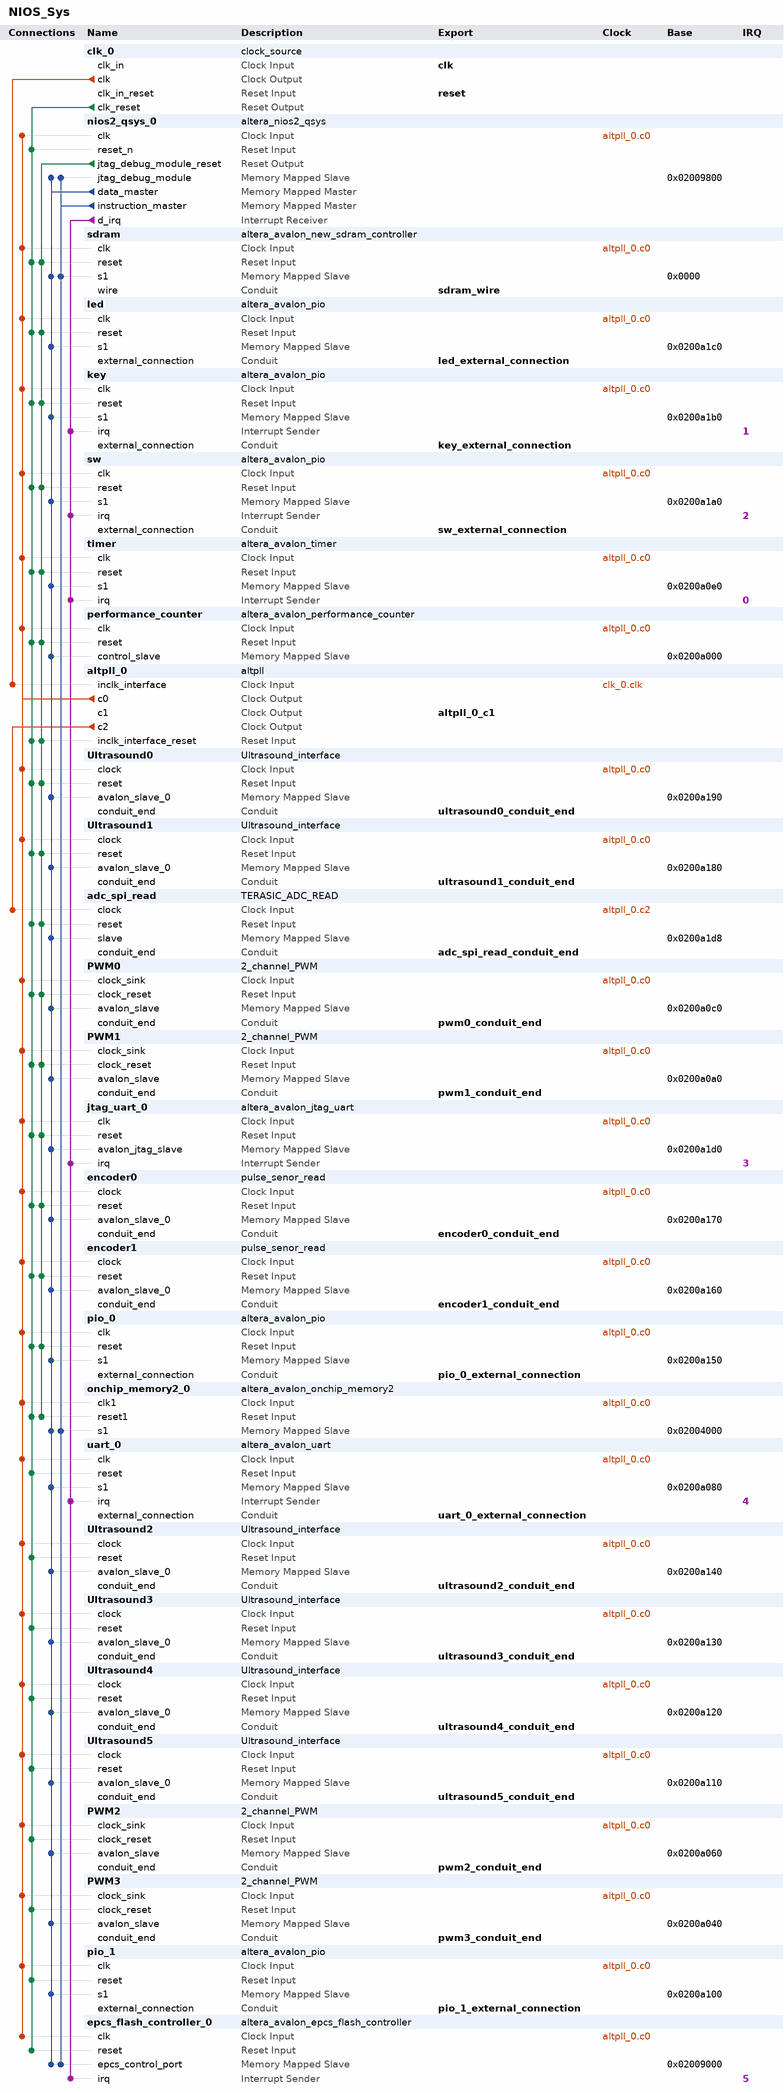
[diagram p0: system contents]
# Platform Designer (Qsys) system NIOS_Sys, Cyclone IV E EP4CE22F17C6
# Parameters at their usual value, and those the tool derives, are not listed.
package require -exact qsys 13.0.1.99.2
create_system NIOS_Sys
set_project_property DEVICE_FAMILY {Cyclone IV E}
set_project_property DEVICE EP4CE22F17C6

add_instance clk_0 clock_source 13.0
set_instance_parameter_value clk_0 clockFrequency 50000000

add_instance nios2_qsys_0 altera_nios2_qsys 13.0
set_instance_parameter_value nios2_qsys_0 resetSlave epcs_flash_controller_0.epcs_control_port
set_instance_parameter_value nios2_qsys_0 mmu_TLBMissExcSlave None
set_instance_parameter_value nios2_qsys_0 exceptionSlave sdram.s1
set_instance_parameter_value nios2_qsys_0 breakSlave nios2_qsys_0.jtag_debug_module
set_instance_parameter_value nios2_qsys_0 impl Tiny
set_instance_parameter_value nios2_qsys_0 icache_size 4096
set_instance_parameter_value nios2_qsys_0 dcache_size 4096

add_instance sdram altera_avalon_new_sdram_controller 13.0.1.99.2
set_instance_parameter_value sdram TAC 5.5
set_instance_parameter_value sdram TRCD 20.0
set_instance_parameter_value sdram TRP 20.0
set_instance_parameter_value sdram casLatency 3
set_instance_parameter_value sdram columnWidth 9
set_instance_parameter_value sdram dataWidth 16
set_instance_parameter_value sdram generateSimulationModel true
set_instance_parameter_value sdram model single_Micron_MT48LC4M32B2_7_chip
set_instance_parameter_value sdram numberOfBanks 4
set_instance_parameter_value sdram numberOfChipSelects 1
set_instance_parameter_value sdram powerUpDelay 100.0
set_instance_parameter_value sdram refreshPeriod 15.625
set_instance_parameter_value sdram rowWidth 13

add_instance led altera_avalon_pio 13.0.1.99.2
set_instance_parameter_value led direction Output
set_instance_parameter_value led width 8

add_instance key altera_avalon_pio 13.0.1.99.2
set_instance_parameter_value key captureEdge true
set_instance_parameter_value key direction Input
set_instance_parameter_value key edgeType FALLING
set_instance_parameter_value key generateIRQ true
set_instance_parameter_value key irqType EDGE
set_instance_parameter_value key width 2

add_instance sw altera_avalon_pio 13.0.1.99.2
set_instance_parameter_value sw captureEdge true
set_instance_parameter_value sw direction Input
set_instance_parameter_value sw edgeType ANY
set_instance_parameter_value sw generateIRQ true
set_instance_parameter_value sw irqType EDGE
set_instance_parameter_value sw width 4

add_instance timer altera_avalon_timer 13.0.1.99.2
set_instance_parameter_value timer period 1
set_instance_parameter_value timer periodUnits MSEC

add_instance performance_counter altera_avalon_performance_counter 13.0.1.99.2
set_instance_parameter_value performance_counter numberOfSections 3

add_instance altpll_0 altpll 13.0
set_instance_parameter_value altpll_0 INCLK0_INPUT_FREQUENCY 20000
set_instance_parameter_value altpll_0 CLK0_MULTIPLY_BY 1
set_instance_parameter_value altpll_0 CLK1_MULTIPLY_BY 1
set_instance_parameter_value altpll_0 CLK2_MULTIPLY_BY 1
set_instance_parameter_value altpll_0 CLK0_DIVIDE_BY 1
set_instance_parameter_value altpll_0 CLK1_DIVIDE_BY 1
set_instance_parameter_value altpll_0 CLK2_DIVIDE_BY 25
set_instance_parameter_value altpll_0 CLK1_PHASE_SHIFT -3333
set_instance_parameter_value altpll_0 CLK2_PHASE_SHIFT 0
set_instance_parameter_value altpll_0 CLK1_DUTY_CYCLE 50
set_instance_parameter_value altpll_0 CLK2_DUTY_CYCLE 50
set_instance_parameter_value altpll_0 PORT_clk1 PORT_USED
set_instance_parameter_value altpll_0 PORT_clk2 PORT_USED
set_instance_parameter_value altpll_0 PORT_clk3 PORT_UNUSED
set_instance_parameter_value altpll_0 PORT_ARESET PORT_UNUSED
set_instance_parameter_value altpll_0 PORT_LOCKED PORT_UNUSED

add_instance Ultrasound0 Ultrasound_interface 1.0
set_instance_parameter_value Ultrasound0 idle 1
set_instance_parameter_value Ultrasound0 trigger 2
set_instance_parameter_value Ultrasound0 wait_feedback 4
set_instance_parameter_value Ultrasound0 measure_feedback 8

add_instance Ultrasound1 Ultrasound_interface 1.0
set_instance_parameter_value Ultrasound1 idle 1
set_instance_parameter_value Ultrasound1 trigger 2
set_instance_parameter_value Ultrasound1 wait_feedback 4
set_instance_parameter_value Ultrasound1 measure_feedback 8

add_instance adc_spi_read TERASIC_ADC_READ 1.0

add_instance PWM0 2_channel_PWM 1.0

add_instance PWM1 2_channel_PWM 1.0

add_instance jtag_uart_0 altera_avalon_jtag_uart 13.0.1.99.2
set_instance_parameter_value jtag_uart_0 simInteractiveOptions NO_INTERACTIVE_WINDOWS

add_instance encoder0 pulse_senor_read 1.0

add_instance encoder1 pulse_senor_read 1.0

add_instance pio_0 altera_avalon_pio 13.0.1.99.2
set_instance_parameter_value pio_0 direction Output
set_instance_parameter_value pio_0 width 8

add_instance onchip_memory2_0 altera_avalon_onchip_memory2 13.0.1.99.2
set_instance_parameter_value onchip_memory2_0 dataWidth 32
set_instance_parameter_value onchip_memory2_0 dualPort false
set_instance_parameter_value onchip_memory2_0 initMemContent true
set_instance_parameter_value onchip_memory2_0 initializationFileName onchip_mem.hex
set_instance_parameter_value onchip_memory2_0 memorySize 16384

add_instance uart_0 altera_avalon_uart 13.0.1.99.2
set_instance_parameter_value uart_0 baud 115200
set_instance_parameter_value uart_0 dataBits 8
set_instance_parameter_value uart_0 fixedBaud true
set_instance_parameter_value uart_0 parity NONE
set_instance_parameter_value uart_0 stopBits 1

add_instance Ultrasound2 Ultrasound_interface 1.0
set_instance_parameter_value Ultrasound2 idle 1
set_instance_parameter_value Ultrasound2 trigger 2
set_instance_parameter_value Ultrasound2 wait_feedback 4
set_instance_parameter_value Ultrasound2 measure_feedback 8

add_instance Ultrasound3 Ultrasound_interface 1.0
set_instance_parameter_value Ultrasound3 idle 1
set_instance_parameter_value Ultrasound3 trigger 2
set_instance_parameter_value Ultrasound3 wait_feedback 4
set_instance_parameter_value Ultrasound3 measure_feedback 8

add_instance Ultrasound4 Ultrasound_interface 1.0
set_instance_parameter_value Ultrasound4 idle 1
set_instance_parameter_value Ultrasound4 trigger 2
set_instance_parameter_value Ultrasound4 wait_feedback 4
set_instance_parameter_value Ultrasound4 measure_feedback 8

add_instance Ultrasound5 Ultrasound_interface 1.0
set_instance_parameter_value Ultrasound5 idle 1
set_instance_parameter_value Ultrasound5 trigger 2
set_instance_parameter_value Ultrasound5 wait_feedback 4
set_instance_parameter_value Ultrasound5 measure_feedback 8

add_instance PWM2 2_channel_PWM 1.0

add_instance PWM3 2_channel_PWM 1.0

add_instance pio_1 altera_avalon_pio 13.0.1.99.2
set_instance_parameter_value pio_1 direction Input
set_instance_parameter_value pio_1 width 4

add_instance epcs_flash_controller_0 altera_avalon_epcs_flash_controller 13.0.1.99.2

# connections
add_connection altpll_0.c0 encoder0.clock clock
add_connection altpll_0.c0 encoder1.clock clock
add_connection altpll_0.c0 epcs_flash_controller_0.clk clock
add_connection altpll_0.c0 jtag_uart_0.clk clock
add_connection altpll_0.c0 key.clk clock
add_connection altpll_0.c0 led.clk clock
add_connection altpll_0.c0 nios2_qsys_0.clk clock
add_connection altpll_0.c0 onchip_memory2_0.clk1 clock
add_connection altpll_0.c0 performance_counter.clk clock
add_connection altpll_0.c0 pio_0.clk clock
add_connection altpll_0.c0 pio_1.clk clock
add_connection altpll_0.c0 PWM0.clock_sink clock
add_connection altpll_0.c0 PWM1.clock_sink clock
add_connection altpll_0.c0 PWM2.clock_sink clock
add_connection altpll_0.c0 PWM3.clock_sink clock
add_connection altpll_0.c0 sdram.clk clock
add_connection altpll_0.c0 sw.clk clock
add_connection altpll_0.c0 timer.clk clock
add_connection altpll_0.c0 uart_0.clk clock
add_connection altpll_0.c0 Ultrasound0.clock clock
add_connection altpll_0.c0 Ultrasound1.clock clock
add_connection altpll_0.c0 Ultrasound2.clock clock
add_connection altpll_0.c0 Ultrasound3.clock clock
add_connection altpll_0.c0 Ultrasound4.clock clock
add_connection altpll_0.c0 Ultrasound5.clock clock
add_connection altpll_0.c2 adc_spi_read.clock clock
add_connection clk_0.clk altpll_0.inclk_interface clock
add_connection clk_0.clk_reset adc_spi_read.reset reset
add_connection clk_0.clk_reset altpll_0.inclk_interface_reset reset
add_connection clk_0.clk_reset encoder0.reset reset
add_connection clk_0.clk_reset encoder1.reset reset
add_connection clk_0.clk_reset epcs_flash_controller_0.reset reset
add_connection clk_0.clk_reset jtag_uart_0.reset reset
add_connection clk_0.clk_reset key.reset reset
add_connection clk_0.clk_reset led.reset reset
add_connection clk_0.clk_reset nios2_qsys_0.reset_n reset
add_connection clk_0.clk_reset onchip_memory2_0.reset1 reset
add_connection clk_0.clk_reset performance_counter.reset reset
add_connection clk_0.clk_reset pio_0.reset reset
add_connection clk_0.clk_reset pio_1.reset reset
add_connection clk_0.clk_reset PWM0.clock_reset reset
add_connection clk_0.clk_reset PWM1.clock_reset reset
add_connection clk_0.clk_reset PWM2.clock_reset reset
add_connection clk_0.clk_reset PWM3.clock_reset reset
add_connection clk_0.clk_reset sdram.reset reset
add_connection clk_0.clk_reset sw.reset reset
add_connection clk_0.clk_reset timer.reset reset
add_connection clk_0.clk_reset uart_0.reset reset
add_connection clk_0.clk_reset Ultrasound0.reset reset
add_connection clk_0.clk_reset Ultrasound1.reset reset
add_connection clk_0.clk_reset Ultrasound2.reset reset
add_connection clk_0.clk_reset Ultrasound3.reset reset
add_connection clk_0.clk_reset Ultrasound4.reset reset
add_connection clk_0.clk_reset Ultrasound5.reset reset
add_connection nios2_qsys_0.jtag_debug_module_reset adc_spi_read.reset reset
add_connection nios2_qsys_0.jtag_debug_module_reset altpll_0.inclk_interface_reset reset
add_connection nios2_qsys_0.jtag_debug_module_reset encoder0.reset reset
add_connection nios2_qsys_0.jtag_debug_module_reset encoder1.reset reset
add_connection nios2_qsys_0.jtag_debug_module_reset jtag_uart_0.reset reset
add_connection nios2_qsys_0.jtag_debug_module_reset key.reset reset
add_connection nios2_qsys_0.jtag_debug_module_reset led.reset reset
add_connection nios2_qsys_0.jtag_debug_module_reset onchip_memory2_0.reset1 reset
add_connection nios2_qsys_0.jtag_debug_module_reset performance_counter.reset reset
add_connection nios2_qsys_0.jtag_debug_module_reset pio_0.reset reset
add_connection nios2_qsys_0.jtag_debug_module_reset PWM0.clock_reset reset
add_connection nios2_qsys_0.jtag_debug_module_reset PWM1.clock_reset reset
add_connection nios2_qsys_0.jtag_debug_module_reset sdram.reset reset
add_connection nios2_qsys_0.jtag_debug_module_reset sw.reset reset
add_connection nios2_qsys_0.jtag_debug_module_reset timer.reset reset
add_connection nios2_qsys_0.jtag_debug_module_reset Ultrasound0.reset reset
add_connection nios2_qsys_0.jtag_debug_module_reset Ultrasound1.reset reset
add_connection nios2_qsys_0.data_master adc_spi_read.slave avalon
set_connection_parameter_value nios2_qsys_0.data_master/adc_spi_read.slave baseAddress 0x0200a1d8
add_connection nios2_qsys_0.data_master encoder0.avalon_slave_0 avalon
set_connection_parameter_value nios2_qsys_0.data_master/encoder0.avalon_slave_0 baseAddress 0x0200a170
add_connection nios2_qsys_0.data_master encoder1.avalon_slave_0 avalon
set_connection_parameter_value nios2_qsys_0.data_master/encoder1.avalon_slave_0 baseAddress 0x0200a160
add_connection nios2_qsys_0.data_master epcs_flash_controller_0.epcs_control_port avalon
set_connection_parameter_value nios2_qsys_0.data_master/epcs_flash_controller_0.epcs_control_port baseAddress 0x02009000
add_connection nios2_qsys_0.data_master jtag_uart_0.avalon_jtag_slave avalon
set_connection_parameter_value nios2_qsys_0.data_master/jtag_uart_0.avalon_jtag_slave baseAddress 0x0200a1d0
add_connection nios2_qsys_0.data_master key.s1 avalon
set_connection_parameter_value nios2_qsys_0.data_master/key.s1 baseAddress 0x0200a1b0
add_connection nios2_qsys_0.data_master led.s1 avalon
set_connection_parameter_value nios2_qsys_0.data_master/led.s1 baseAddress 0x0200a1c0
add_connection nios2_qsys_0.data_master nios2_qsys_0.jtag_debug_module avalon
set_connection_parameter_value nios2_qsys_0.data_master/nios2_qsys_0.jtag_debug_module baseAddress 0x02009800
add_connection nios2_qsys_0.data_master onchip_memory2_0.s1 avalon
set_connection_parameter_value nios2_qsys_0.data_master/onchip_memory2_0.s1 baseAddress 0x02004000
add_connection nios2_qsys_0.data_master performance_counter.control_slave avalon
set_connection_parameter_value nios2_qsys_0.data_master/performance_counter.control_slave baseAddress 0x0200a000
add_connection nios2_qsys_0.data_master pio_0.s1 avalon
set_connection_parameter_value nios2_qsys_0.data_master/pio_0.s1 baseAddress 0x0200a150
add_connection nios2_qsys_0.data_master pio_1.s1 avalon
set_connection_parameter_value nios2_qsys_0.data_master/pio_1.s1 baseAddress 0x0200a100
add_connection nios2_qsys_0.data_master PWM0.avalon_slave avalon
set_connection_parameter_value nios2_qsys_0.data_master/PWM0.avalon_slave baseAddress 0x0200a0c0
add_connection nios2_qsys_0.data_master PWM1.avalon_slave avalon
set_connection_parameter_value nios2_qsys_0.data_master/PWM1.avalon_slave baseAddress 0x0200a0a0
add_connection nios2_qsys_0.data_master PWM2.avalon_slave avalon
set_connection_parameter_value nios2_qsys_0.data_master/PWM2.avalon_slave baseAddress 0x0200a060
add_connection nios2_qsys_0.data_master PWM3.avalon_slave avalon
set_connection_parameter_value nios2_qsys_0.data_master/PWM3.avalon_slave baseAddress 0x0200a040
add_connection nios2_qsys_0.data_master sdram.s1 avalon
set_connection_parameter_value nios2_qsys_0.data_master/sdram.s1 baseAddress 0x0000
add_connection nios2_qsys_0.data_master sw.s1 avalon
set_connection_parameter_value nios2_qsys_0.data_master/sw.s1 baseAddress 0x0200a1a0
add_connection nios2_qsys_0.data_master timer.s1 avalon
set_connection_parameter_value nios2_qsys_0.data_master/timer.s1 baseAddress 0x0200a0e0
add_connection nios2_qsys_0.data_master uart_0.s1 avalon
set_connection_parameter_value nios2_qsys_0.data_master/uart_0.s1 baseAddress 0x0200a080
add_connection nios2_qsys_0.data_master Ultrasound0.avalon_slave_0 avalon
set_connection_parameter_value nios2_qsys_0.data_master/Ultrasound0.avalon_slave_0 baseAddress 0x0200a190
add_connection nios2_qsys_0.data_master Ultrasound1.avalon_slave_0 avalon
set_connection_parameter_value nios2_qsys_0.data_master/Ultrasound1.avalon_slave_0 baseAddress 0x0200a180
add_connection nios2_qsys_0.data_master Ultrasound2.avalon_slave_0 avalon
set_connection_parameter_value nios2_qsys_0.data_master/Ultrasound2.avalon_slave_0 baseAddress 0x0200a140
add_connection nios2_qsys_0.data_master Ultrasound3.avalon_slave_0 avalon
set_connection_parameter_value nios2_qsys_0.data_master/Ultrasound3.avalon_slave_0 baseAddress 0x0200a130
add_connection nios2_qsys_0.data_master Ultrasound4.avalon_slave_0 avalon
set_connection_parameter_value nios2_qsys_0.data_master/Ultrasound4.avalon_slave_0 baseAddress 0x0200a120
add_connection nios2_qsys_0.data_master Ultrasound5.avalon_slave_0 avalon
set_connection_parameter_value nios2_qsys_0.data_master/Ultrasound5.avalon_slave_0 baseAddress 0x0200a110
add_connection nios2_qsys_0.instruction_master epcs_flash_controller_0.epcs_control_port avalon
set_connection_parameter_value nios2_qsys_0.instruction_master/epcs_flash_controller_0.epcs_control_port baseAddress 0x02009000
add_connection nios2_qsys_0.instruction_master nios2_qsys_0.jtag_debug_module avalon
set_connection_parameter_value nios2_qsys_0.instruction_master/nios2_qsys_0.jtag_debug_module baseAddress 0x02009800
add_connection nios2_qsys_0.instruction_master onchip_memory2_0.s1 avalon
set_connection_parameter_value nios2_qsys_0.instruction_master/onchip_memory2_0.s1 baseAddress 0x02004000
add_connection nios2_qsys_0.instruction_master sdram.s1 avalon
set_connection_parameter_value nios2_qsys_0.instruction_master/sdram.s1 baseAddress 0x0000
add_connection nios2_qsys_0.d_irq epcs_flash_controller_0.irq interrupt
set_connection_parameter_value nios2_qsys_0.d_irq/epcs_flash_controller_0.irq irqNumber 5
add_connection nios2_qsys_0.d_irq jtag_uart_0.irq interrupt
set_connection_parameter_value nios2_qsys_0.d_irq/jtag_uart_0.irq irqNumber 3
add_connection nios2_qsys_0.d_irq key.irq interrupt
set_connection_parameter_value nios2_qsys_0.d_irq/key.irq irqNumber 1
add_connection nios2_qsys_0.d_irq sw.irq interrupt
set_connection_parameter_value nios2_qsys_0.d_irq/sw.irq irqNumber 2
add_connection nios2_qsys_0.d_irq timer.irq interrupt
set_connection_parameter_value nios2_qsys_0.d_irq/timer.irq irqNumber 0
add_connection nios2_qsys_0.d_irq uart_0.irq interrupt
set_connection_parameter_value nios2_qsys_0.d_irq/uart_0.irq irqNumber 4

# exported interfaces
add_interface led_external_connection conduit end
set_interface_property led_external_connection EXPORT_OF led.external_connection
add_interface sdram_wire conduit end
set_interface_property sdram_wire EXPORT_OF sdram.wire
add_interface key_external_connection conduit end
set_interface_property key_external_connection EXPORT_OF key.external_connection
add_interface sw_external_connection conduit end
set_interface_property sw_external_connection EXPORT_OF sw.external_connection
add_interface reset reset sink
set_interface_property reset EXPORT_OF clk_0.clk_in_reset
add_interface altpll_0_c1 clock source
set_interface_property altpll_0_c1 EXPORT_OF altpll_0.c1
add_interface clk clock sink
set_interface_property clk EXPORT_OF clk_0.clk_in
add_interface ultrasound0_conduit_end conduit end
set_interface_property ultrasound0_conduit_end EXPORT_OF Ultrasound0.conduit_end
add_interface ultrasound1_conduit_end conduit end
set_interface_property ultrasound1_conduit_end EXPORT_OF Ultrasound1.conduit_end
add_interface adc_spi_read_conduit_end conduit end
set_interface_property adc_spi_read_conduit_end EXPORT_OF adc_spi_read.conduit_end
add_interface pwm0_conduit_end conduit end
set_interface_property pwm0_conduit_end EXPORT_OF PWM0.conduit_end
add_interface pwm1_conduit_end conduit end
set_interface_property pwm1_conduit_end EXPORT_OF PWM1.conduit_end
add_interface encoder0_conduit_end conduit end
set_interface_property encoder0_conduit_end EXPORT_OF encoder0.conduit_end
add_interface encoder1_conduit_end conduit end
set_interface_property encoder1_conduit_end EXPORT_OF encoder1.conduit_end
add_interface pio_0_external_connection conduit end
set_interface_property pio_0_external_connection EXPORT_OF pio_0.external_connection
add_interface uart_0_external_connection conduit end
set_interface_property uart_0_external_connection EXPORT_OF uart_0.external_connection
add_interface ultrasound2_conduit_end conduit end
set_interface_property ultrasound2_conduit_end EXPORT_OF Ultrasound2.conduit_end
add_interface ultrasound3_conduit_end conduit end
set_interface_property ultrasound3_conduit_end EXPORT_OF Ultrasound3.conduit_end
add_interface ultrasound5_conduit_end conduit end
set_interface_property ultrasound5_conduit_end EXPORT_OF Ultrasound5.conduit_end
add_interface pwm2_conduit_end conduit end
set_interface_property pwm2_conduit_end EXPORT_OF PWM2.conduit_end
add_interface pwm3_conduit_end conduit end
set_interface_property pwm3_conduit_end EXPORT_OF PWM3.conduit_end
add_interface ultrasound4_conduit_end conduit end
set_interface_property ultrasound4_conduit_end EXPORT_OF Ultrasound4.conduit_end
add_interface pio_1_external_connection conduit end
set_interface_property pio_1_external_connection EXPORT_OF pio_1.external_connection

set_interconnect_requirement {$system} qsys_mm.clockCrossingAdapter HANDSHAKE
set_interconnect_requirement {$system} qsys_mm.maxAdditionalLatency 1

save_system NIOS_Sys.qsys
